# Altium project UCLA-DRS4.PrjPCB (part 5 of 10)

## Sheet CLK_SYNTH.SchDoc: My title
size A3; Organization: University of California; Address1: 475 Portola Plaza; Address2: Los Angeles, CA 90095; DocumentNumber: 14; Revision: R01; SheetNumber: 14; SheetTotal: 35
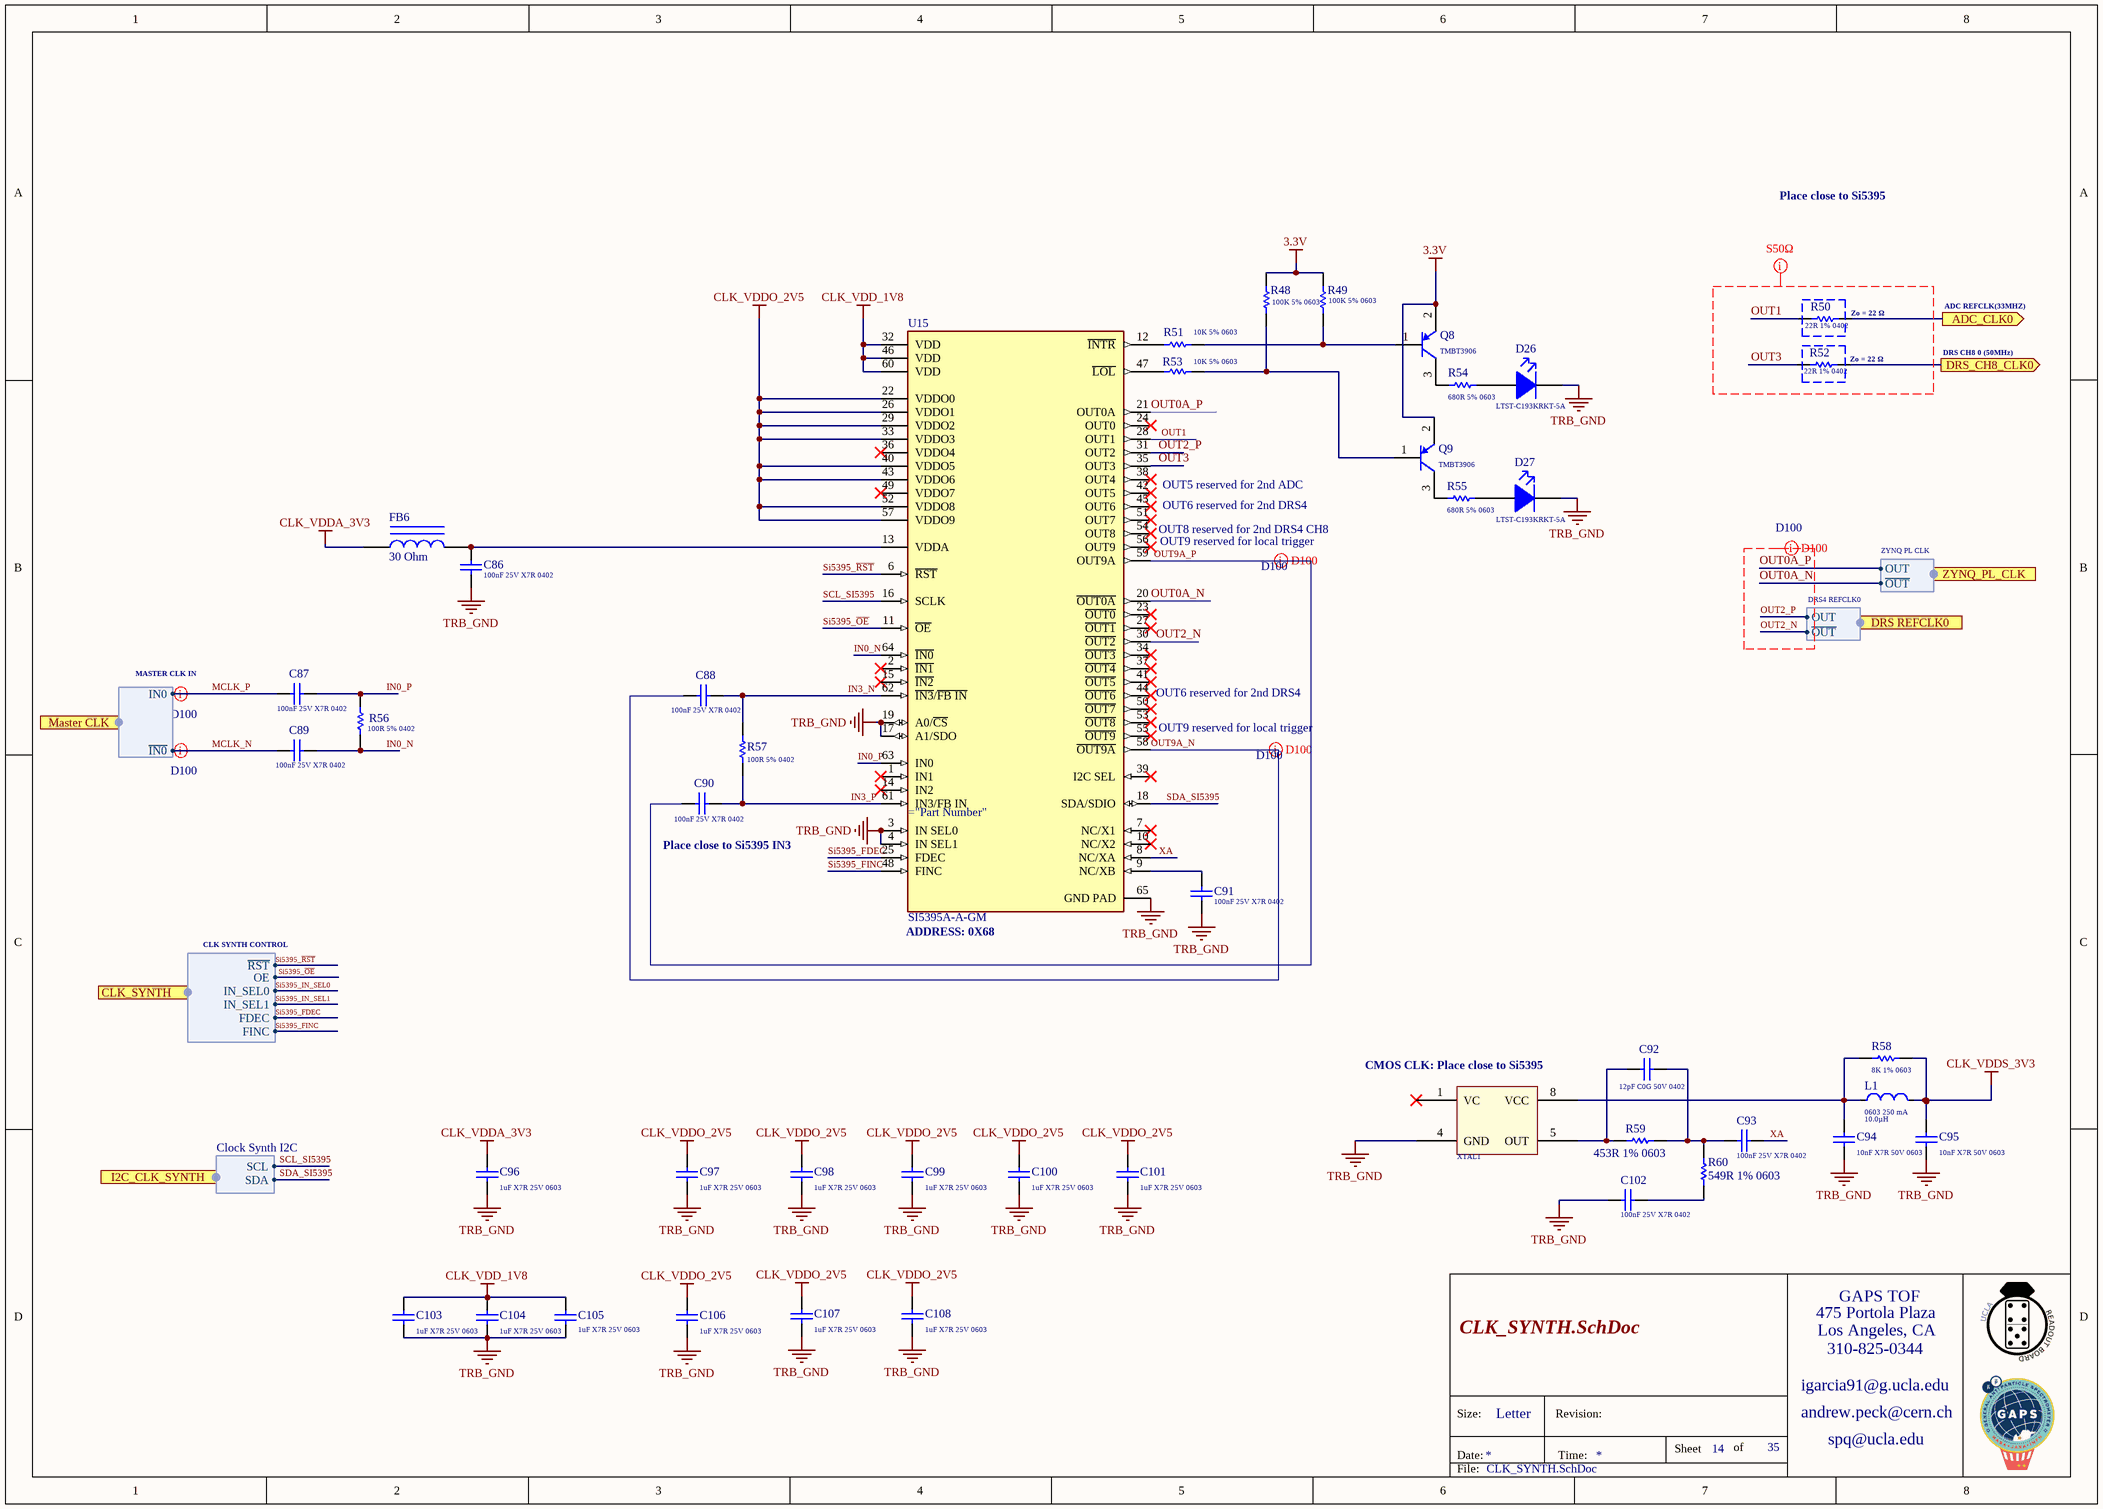
[diagram p9: CLK_SYNTH.SchDoc]

### Parts
C86  Capacitance: 100nF 25V X7R 0402  [Cap_Taiyo_Yuden_TMK105B7104KV-FR_100nF]  (hidden comment: Cap_Taiyo_Yuden_TMK105B7104KV-FR_100nF)
C87  Capacitance: 100nF 25V X7R 0402  [Cap_Taiyo_Yuden_TMK105B7104KV-FR_100nF]  (hidden comment: Cap_Taiyo_Yuden_TMK105B7104KV-FR_100nF)
C88  Capacitance: 100nF 25V X7R 0402  [Cap_Taiyo_Yuden_TMK105B7104KV-FR_100nF]  (hidden comment: Cap_Taiyo_Yuden_TMK105B7104KV-FR_100nF)
C89  Capacitance: 100nF 25V X7R 0402  [Cap_Taiyo_Yuden_TMK105B7104KV-FR_100nF]  (hidden comment: Cap_Taiyo_Yuden_TMK105B7104KV-FR_100nF)
C90  Capacitance: 100nF 25V X7R 0402  [Cap_Taiyo_Yuden_TMK105B7104KV-FR_100nF]  (hidden comment: Cap_Taiyo_Yuden_TMK105B7104KV-FR_100nF)
C91  Capacitance: 100nF 25V X7R 0402  [Cap_Taiyo_Yuden_TMK105B7104KV-FR_100nF]  (hidden comment: Cap_Taiyo_Yuden_TMK105B7104KV-FR_100nF)
C92  Capacitance: 12pF C0G 50V 0402  [Cap_Murata_GCQ1555C1H120FB01D_12pF]  (hidden comment: Cap_Murata_GCQ1555C1H120FB01D_12pF)
C93  Capacitance: 100nF 25V X7R 0402  [Cap_Taiyo_Yuden_TMK105B7104KV-FR_100nF]  (hidden comment: Cap_Taiyo_Yuden_TMK105B7104KV-FR_100nF)
C94  Capacitance: 10nF X7R 50V 0603  [Kemet_C0603_0]  (hidden comment: Cap_Kemet_C0603C103J5RACTU_eec)
C95  Capacitance: 10nF X7R 50V 0603  [Kemet_C0603_0]  (hidden comment: Cap_Kemet_C0603C103J5RACTU_eec)
C96  Capacitance: 1uF X7R 25V 0603  [Cap_Murata_GCJ188R71E105KA01J_1uF]  (hidden comment: Cap_Murata_GCJ188R71E105KA01J_1uF)
C97  Capacitance: 1uF X7R 25V 0603  [Cap_Murata_GCJ188R71E105KA01J_1uF]  (hidden comment: Cap_Murata_GCJ188R71E105KA01J_1uF)
C98  Capacitance: 1uF X7R 25V 0603  [Cap_Murata_GCJ188R71E105KA01J_1uF]  (hidden comment: Cap_Murata_GCJ188R71E105KA01J_1uF)
C99  Capacitance: 1uF X7R 25V 0603  [Cap_Murata_GCJ188R71E105KA01J_1uF]  (hidden comment: Cap_Murata_GCJ188R71E105KA01J_1uF)
C100  Capacitance: 1uF X7R 25V 0603  [Cap_Murata_GCJ188R71E105KA01J_1uF]  (hidden comment: Cap_Murata_GCJ188R71E105KA01J_1uF)
C101  Capacitance: 1uF X7R 25V 0603  [Cap_Murata_GCJ188R71E105KA01J_1uF]  (hidden comment: Cap_Murata_GCJ188R71E105KA01J_1uF)
C102  Capacitance: 100nF 25V X7R 0402  [Cap_Taiyo_Yuden_TMK105B7104KV-FR_100nF]  (hidden comment: Cap_Taiyo_Yuden_TMK105B7104KV-FR_100nF)
C103  Capacitance: 1uF X7R 25V 0603  [Cap_Murata_GCJ188R71E105KA01J_1uF]  (hidden comment: Cap_Murata_GCJ188R71E105KA01J_1uF)
C104  Capacitance: 1uF X7R 25V 0603  [Cap_Murata_GCJ188R71E105KA01J_1uF]  (hidden comment: Cap_Murata_GCJ188R71E105KA01J_1uF)
C105  Capacitance: 1uF X7R 25V 0603  [Cap_Murata_GCJ188R71E105KA01J_1uF]  (hidden comment: Cap_Murata_GCJ188R71E105KA01J_1uF)
C106  Capacitance: 1uF X7R 25V 0603  [Cap_Murata_GCJ188R71E105KA01J_1uF]  (hidden comment: Cap_Murata_GCJ188R71E105KA01J_1uF)
C107  Capacitance: 1uF X7R 25V 0603  [Cap_Murata_GCJ188R71E105KA01J_1uF]  (hidden comment: Cap_Murata_GCJ188R71E105KA01J_1uF)
C108  Capacitance: 1uF X7R 25V 0603  [Cap_Murata_GCJ188R71E105KA01J_1uF]  (hidden comment: Cap_Murata_GCJ188R71E105KA01J_1uF)
D26  LTST-C193KRKT-5A  [Led_Lite-On_LTST-C193KGKT-5A_Red]
D27  LTST-C193KRKT-5A  [Led_Lite-On_LTST-C193KGKT-5A_Red]
FB6  30 Ohm  [Feb_MURATA_BLM15AX300SZ1D_30]
L1  0603 250 mA  Inductance: 10.0µH  [TDK_MLZ1608M100WT_0]
Q8  Series: TMBT3906  [BJT_PNP_Toshiba_TMBT3906]  (hidden comment: BJT_PNP_Toshiba_TMBT3906)
Q9  Series: TMBT3906  [BJT_PNP_Toshiba_TMBT3906]  (hidden comment: BJT_PNP_Toshiba_TMBT3906)
R48  100K 5% 0603  [RESC0603(1608)_N]
R49  100K 5% 0603  [RESC0603(1608)_N]
R50  22R 1% 0402  [RESC0402(1005)_L]
R51  10K 5% 0603  [RESC0603(1608)_L]
R52  22R 1% 0402  [RESC0402(1005)_L]
R53  10K 5% 0603  [RESC0603(1608)_L]
R54  680R 5% 0603  [RESC0603(1608)_L]
R55  680R 5% 0603  [RESC0603(1608)_L]
R56  100R 5% 0402  [RESC0402(1005)_L]
R57  100R 5% 0402  [RESC0402(1005)_L]
R58  8K 1% 0603  [Res_Yageo_RT0603BRE078KL_8K]
R59  453R 1% 0603  [RESC1608X55X30NL15T15]
R60  549R 1% 0603  [RESC1608X55X30NL15T15]
U15  Series: SI5395A-A-GM  [Si5395]  (hidden comment: IC_Silicon_Laboratories_ SI5395A-A-GM_CLK)
XTAL1  TCXO_Murata_XTCLH50M000CHJA3P0_50MHz  [TCXO_Murata_XTCLH50M000CHJA3P0_50MHz]  (value not drawn)

### Ports
ADC_CLK0 (out), CLK_SYNTH (harness CLK SYNTH CONTROL), DRS REFCLK0 (harness DRS4 REFCLK0), DRS_CH8_CLK0 (out), I2C_CLK_SYNTH (harness Clock Synth I2C), Master CLK (harness MASTER CLK IN), ZYNQ_PL_CLK (harness ZYNQ PL CLK)

### Harnesses
MASTER CLK IN: IN0, ~{IN0}
CLK SYNTH CONTROL: ~{RST}, OE, IN_SEL0, IN_SEL1, FDEC, FINC
DRS4 REFCLK0: OUT, ~{OUT}
ZYNQ PL CLK: OUT, ~{OUT}
Clock Synth I2C: SCL, SDA

### Nets
3.3V: Q8.2(E) Q9.2(E) R48.2 R49.2
CLK_VDD_1V8: C103.2 C104.2 C105.2 U15.32(VDD) U15.46(VDD) U15.60(VDD)
CLK_VDDA_3V3: C96.2 FB6.1
CLK_VDDO_2V5: C97.2 C98.2 C99.2 C100.2 C101.2 C106.2 C107.2 C108.2 U15.22(VDDO0) U15.26(VDDO1) U15.29(VDDO2) U15.33(VDDO3) U15.40(VDDO5) U15.43(VDDO6) U15.52(VDDO8) U15.57(VDDO9)
CLK_VDDS_3V3: C95.1 L1.2 R58.2
TRB_GND: C86.1 C91.1 C94.2 C95.2 C96.1 C97.1 C98.1 C99.1 C100.1 C101.1 C102.1 C103.1 C104.1 C105.1 C106.1 C107.1 C108.1 D26.1(K) D27.1(K) U15.3(IN_SEL0) U15.4(IN_SEL1) U15.17(A1/SDO) U15.19(A0/~{CS}) U15.65(GND_PAD) XTAL1.4(GND)
ADC_CLK: R50.1 ; port ADC_CLK0
CLK_SYNTH_8: R52.1 ; port DRS_CH8_CLK0
IN0_N: C89.2 R56.1 U15.64(~{IN0})
IN0_P: C87.2 R56.2 U15.63(IN0)
IN3_N: C88.2 R57.2 U15.62(~{IN3}/~{FB_IN})
IN3_P: C90.2 R57.1 U15.61(IN3/FB_IN)
MCLK_N: C89.1 ; port Master CLK.~{IN0}
MCLK_P: C87.1 ; port Master CLK.IN0
OUT0A_N: U15.20(~{OUT0A}) ; port ZYNQ_PL_CLK.~{OUT}
OUT0A_P: U15.21(OUT0A) ; port ZYNQ_PL_CLK.OUT
OUT1: R50.2 U15.28(OUT1)
OUT2_N: U15.30(~{OUT2}) ; port DRS REFCLK0.~{OUT}
OUT2_P: U15.31(OUT2) ; port DRS REFCLK0.OUT
OUT3: R52.2 U15.35(OUT3)
OUT9A_N: C88.1 U15.58(~{OUT9A})
OUT9A_P: C90.1 U15.59(OUT9A)
SCL_SI5395: U15.16(SCLK) ; port I2C_CLK_SYNTH.SCL
SDA_SI5395: U15.18(SDA/SDIO) ; port I2C_CLK_SYNTH.SDA
Si5395_FDEC: U15.25(FDEC) ; port CLK_SYNTH.FDEC
Si5395_FINC: U15.48(FINC) ; port CLK_SYNTH.FINC
Si5395_IN_SEL0: port CLK_SYNTH.IN_SEL0
Si5395_IN_SEL1: port CLK_SYNTH.IN_SEL1
Si5395_~{OE}: U15.11(~{OE}) ; port CLK_SYNTH.OE
Si5395_~{RST}: U15.6(~{RST}) ; port CLK_SYNTH.~{RST}
XA: C93.2 U15.8(NC/XA)
NetC86_2: C86.2 FB6.2 U15.13(VDDA)
NetC91_2: C91.2 U15.9(NC/XB)
NetC92_1: C92.1 C93.1 R59.2 R60.2
NetC92_2: C92.2 R59.1 XTAL1.5(OUT)
NetC94_1: C94.1 L1.1 R58.1 XTAL1.8(VCC)
NetC102_2: C102.2 R60.1
NetD26_2: D26.2(A) R54.2
NetD27_2: D27.2(A) R55.2
NetQ8_1: Q8.1(B) R49.1 R51.1
NetQ8_3: Q8.3(C) R54.1
NetQ9_1: Q9.1(B) R48.1 R53.1
NetQ9_3: Q9.3(C) R55.1
NetR51_2: R51.2 U15.12(~{INTR})
NetR53_2: R53.2 U15.47(~{LOL})

Not connected (* = marked no-connect by the designer): U15 1(IN1)* 2(~{IN1})* 7(NC/X1)* 10(NC/X2)* 14(IN2)* 15(~{IN2})* 23(~{OUT0})* 24(OUT0)* 27(~{OUT1})* 34(~{OUT3})* 36(VDDO4)* 37(~{OUT4})* 38(OUT4)* 39(I2C_SEL)* 41(~{OUT5})* 42(OUT5)* 44(~{OUT6})* 45(OUT6)* 49(VDDO7)* 50(~{OUT7})* 51(OUT7)* 53(~{OUT8})* 54(OUT8)* 55(~{OUT9})* 56(OUT9)*; XTAL1 1(VC)*

### Layout directives
differential pair; differential pair class D100: OUT0A_N, OUT0A_P, OUT2_N, OUT2_P, OUT9A_N, OUT9A_P
net class S50: OUT1, OUT3
differential pair; differential pair class D100; rule Matched Net Lengths [Tolerance = 100mil]: MCLK_N, MCLK_P

### Notes on the sheet
- Place close to Si5395
- (near R50) Zo = 22 Ω
- ADC REFCLK(33MHZ)
- (near R52) Zo = 22 Ω
- DRS CH8 0 (50MHz)
- (near U15) OUT5 reserved for 2nd ADC
- (near U15) OUT6 reserved for 2nd DRS4
- (near U15) OUT8 reserved for 2nd DRS4 CH8
- (near U15) OUT9 reserved for local trigger
- (near C90) Place close to Si5395 IN3
- (near U15) ADDRESS: 0X68
- (near XTAL1) CMOS CLK: Place close to Si5395
- 475 Portola Plaza
- GAPS TOF
- igarcia91@g.ucla.edu
- Los Angeles, CA
- 310-825-0344
- Size:
- Date:
- Letter
- Revision:
- Time:
- Sheet
- of
- andrew.peck@cern.ch
- spq@ucla.edu
- File:

### Library data of the parts
C86-C91 C93 C102 = Cap_Taiyo_Yuden_TMK105B7104KV-FR_100nF: CAP CER 100nF 25V X7R 0402; Supplier 1: Mouser; Supplier Part Number 1: 963-TMK105B7104KV-FR
C92 = Cap_Murata_GCQ1555C1H120FB01D_12pF: MLCC - SMD/SMT 0402 50VDC 12pF 1% AEC-Q200; Manufacturer 1: Murata; Supplier 1: Mouser; Supplier Part Number 1: 81-GCQ1555C1H120FB1D; Manufacturer Part Number 1: GCQ1555C1H120FB01D
C94 C95 = Cap_Kemet_C0603C103J5RACTU_eec: CAP CER 10nF 50V X7R 0603; Manufacturer: Kemet; Mfg Package Ident: C0603; Part Number: C0603C103J5RACTU; helpURL: https://upverter.com/upn/revision/8a8d0c297e33ac74/; ComponentLink2Description: Datasheet; Temperature: -55°C to +125°C; Package: C0603; Supplier 2: Mouser; Price: 0.0184203126773; Supplier 1: Digi-Key; ComponentLink1URL: https://upverter.com/upn/revision/8a8d0c297e33ac74/; Supplier Part Number 2: 80-C0603C103J5R; Supplier Part Number 1: 399-1092-1-ND; Value: 10nF; ComponentLink1Description: Upverter; ComponentLink2URL: https://content.kemet.com/datasheets/KEM_C1002_X7R_SMD.pdf; RoHS: TRUE; Mouser Part Number: 80-C0603C103J5R; Temperature Range High: +125°C; Digikey Description: CAP CER 10000PF 50V X7R 0603; Digikey Part Number: 399-1092-1-ND; Lead Free: yes; Temperature Range Low: -55°C; Voltage: 50V
C96-C101 C103-C108 = Cap_Murata_GCJ188R71E105KA01J_1uF: CAP CER 1uF 25V X7R 0603; Supplier 1: Mouser; Supplier Part Number 1: 81-GCJ188R71E105KA1J
D26 D27 = Led_Lite-On_LTST-C193KGKT-5A_Red: Standard LEDs - SMD Red 470nm 28mcd 20mA; Supplier 1: Mouser; Supplier Part Number 1: 859-LTSTC193KRKT5A; Series: LTST-C193KRKT-5A
FB6 = Feb_MURATA_BLM15AX300SZ1D_30: Feb SMD 30 OHM 25% 3/4W 0402; Supplier 1: Mouser; Supplier Part Number 1: 81-BLM15AX300SZ1D
L1 = Ind_TDK_MLZ1608M100WT_eec: IND 10µH Shielded Multilayer Inductor 250mA 1.365 Ohm Max 0603 (1608 Metric); Manufacturer: TDK; Value: 10.0µH; Tolerance: ±20%; Part Number: MLZ1608M100WT; helpURL: https://upverter.com/upn/revision/22fa022ced0eb0ec/; ComponentLink2Description: Datasheet; Temperature: -55°C to +125°C; Package: 0603 (1608 metric); Supplier 2: Mouser; Supplier 1: Digi-Key; ComponentLink1URL: https://upverter.com/upn/revision/22fa022ced0eb0ec/; Supplier Part Number 2: 810-MLZ1608M100WT000; Supplier Part Number 1: 445-6389-1-ND; ComponentLink1Description: Upverter; ComponentLink2URL: https://product.tdk.com/info/en/catalog/datasheets/inductor_commercial_decoupling_mlz1608_en.pdf; RoHS: TRUE; Mouser Part Number: 810-MLZ1608M100WT000; Current Rating: 250mA; Ipc Land Pattern Name: CAPC16080X45; Temperature Range High: +125°C; Digikey Description: IND 10µH Shielded Multilayer Inductor 250mA 1.365 Ohm Max 0603 (1608 Metric); Digikey Part Number: 445-6389-1-ND; Lead Free: yes; Temperature Range Low: -55°C; DC Resistance (DCR): 1.365 Ohm Max
Q8 Q9 = BJT_PNP_Toshiba_TMBT3906: Bipolar Transistors - BJT Transistor for Low Freq. Amplification; Manufacturer Part Number 1: TMBT3906,LM; Supplier Part Number 1: 757-TMBT3906LM; Supplier 1: Mouser; Manufacturer: Toshiba
R48 R49 = CMP-1012-00122-1: 100K 0.1W 5% 0603 (1608 Metric)  SMD; Case-EIA: 0603; Value: 100000.00 Ohm; Case-Metric: 1608; Tolerance: 5 %; Power: 0.1 W; Technology: SMT
R50 R52 = CMP-1011-00320-1: 22R 0.063W 1% 0402 (1005 Metric)  SMD; Case-EIA: 0402; Case-Metric: 1005; Value: 22.00 Ohm; Tolerance: 1 %; Technology: SMT; Power: 0.063 W
R51 R53 = CMP-1012-00098-1: 10K 0.1W 5% 0603 (1608 Metric)  SMD; Case-EIA: 0603; Value: 10000.00 Ohm; Case-Metric: 1608; Technology: SMT; Tolerance: 5 %; Power: 0.1 W
R54 R55 = CMP-1012-00070-1: 680R 0.1W 5% 0603 (1608 Metric)  SMD; Case-EIA: 0603; Value: 680.00 Ohm; Case-Metric: 1608; Tolerance: 5 %; Technology: SMT; Power: 0.1 W
R56 R57 = CMP-1011-00050-1: 100R 0.063W 5% 0402 (1005 Metric)  SMD; Case-EIA: 0402; Value: 100.00 Ohm; Case-Metric: 1005; Tolerance: 5 %; Technology: SMT; Power: 0.063 W
R58 = Res_Yageo_RT0603BRE078KL_8K: 8K 0.1W 1% 0603 (1608 Metric)  SMD; Supplier 1: Mouser; Supplier Part Number 1: 603-RT0603BRE078KL
R59 = CMP-2000-00511-1: ERJ-3EKF4530V; Manufacturer: Panasonic; Part Number: ERJ-3EKF4530V
R60 = CMP-2000-00559-1: ERJ-3EKF5490V; Manufacturer: Panasonic; Part Number: ERJ-3EKF5490V
U15 = IC_Silicon_Laboratories_ SI5395A-A-GM_CLK: Clock Synthesizer / Jitter Cleaner Single PLL jitter attenuator with xtal: 12-outputs up to 1028 MHz; integer+fractional; Supplier 1: Mouser; Supplier Part Number 1: 634-SI5395A-A-GM
XTAL1 = TCXO_Murata_XTCLH50M000CHJA3P0_50MHz: TCXO Oscillators 50MHz 5x3.2x1.5mm 0.2ppm max Crystal; Supplier 1: Mouser; Supplier Part Number 1: 81-XTCLH50M000CHJA3P; Supplier 2: Digi-Key; Supplier Part Number 2: 490-18042-1-ND

## Sheet TCA_MODULE.SchDoc: My title
size A3; Organization: University of California; Address1: 475 Portola Plaza; Address2: Los Angeles, CA 90095; DocumentNumber: 25; Revision: R01; SheetNumber: 25; SheetTotal: 35
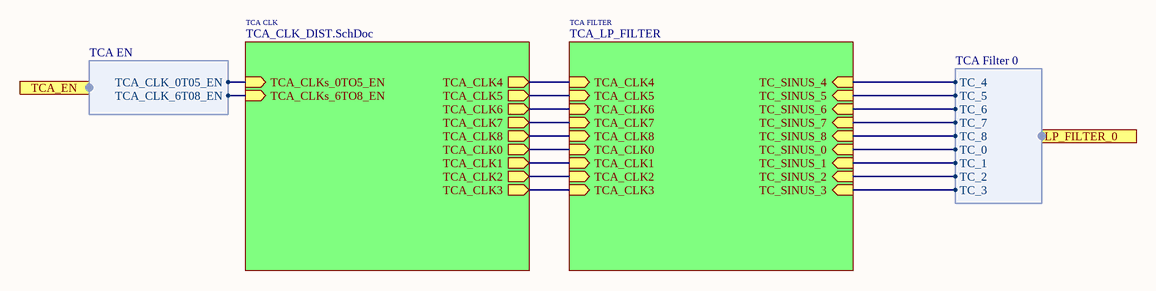
[diagram p10: TCA_MODULE.SchDoc]

### Sub-sheets
TCA CLK = TCA_CLK_DIST.SchDoc: TCA_CLK4 (out), TCA_CLK5 (out), TCA_CLK6 (out), TCA_CLK7 (out), TCA_CLK8 (out), TCA_CLK0 (out), TCA_CLK1 (out), TCA_CLK2 (out), TCA_CLKs_0TO5_EN (in), TCA_CLKs_6TO8_EN (in), TCA_CLK3 (out)
TCA FILTER = TCA_LP_FILTER: TCA_CLK4 (in), TCA_CLK5 (in), TCA_CLK6 (in), TCA_CLK0 (in), TCA_CLK1 (in), TCA_CLK2 (in), TCA_CLK3 (in), TCA_CLK7 (in), TCA_CLK8 (in), TC_SINUS_4 (in), TC_SINUS_5 (in), TC_SINUS_6 (in), TC_SINUS_0 (in), TC_SINUS_1 (in), TC_SINUS_2 (in), TC_SINUS_3 (in), TC_SINUS_7 (in), TC_SINUS_8 (in)

### Ports
LP_FILTER_0 (harness TCA Filter 0), TCA_EN (harness TCA EN)

### Harnesses
TCA Filter 0: TC_4, TC_5, TC_6, TC_7, TC_8, TC_0, TC_1, TC_2, TC_3
TCA EN: TCA_CLK_0T05_EN, TCA_CLK_6T08_EN

### Nets
TC_0: sheet TCA FILTER/TC_SINUS_0, port LP_FILTER_0.TC_0
TC_1: sheet TCA FILTER/TC_SINUS_1, port LP_FILTER_0.TC_1
TC_2: sheet TCA FILTER/TC_SINUS_2, port LP_FILTER_0.TC_2
TC_3: sheet TCA FILTER/TC_SINUS_3, port LP_FILTER_0.TC_3
TC_4: sheet TCA FILTER/TC_SINUS_4, port LP_FILTER_0.TC_4
TC_5: sheet TCA FILTER/TC_SINUS_5, port LP_FILTER_0.TC_5
TC_6: sheet TCA FILTER/TC_SINUS_6, port LP_FILTER_0.TC_6
TC_7: sheet TCA FILTER/TC_SINUS_7, port LP_FILTER_0.TC_7
TC_8: sheet TCA FILTER/TC_SINUS_8, port LP_FILTER_0.TC_8
TCA_CLK0: sheet TCA CLK/TCA_CLK0, sheet TCA FILTER/TCA_CLK0
TCA_CLK1: sheet TCA CLK/TCA_CLK1, sheet TCA FILTER/TCA_CLK1
TCA_CLK2: sheet TCA CLK/TCA_CLK2, sheet TCA FILTER/TCA_CLK2
TCA_CLK3: sheet TCA CLK/TCA_CLK3, sheet TCA FILTER/TCA_CLK3
TCA_CLK4: sheet TCA CLK/TCA_CLK4, sheet TCA FILTER/TCA_CLK4
TCA_CLK5: sheet TCA CLK/TCA_CLK5, sheet TCA FILTER/TCA_CLK5
TCA_CLK6: sheet TCA CLK/TCA_CLK6, sheet TCA FILTER/TCA_CLK6
TCA_CLK7: sheet TCA CLK/TCA_CLK7, sheet TCA FILTER/TCA_CLK7
TCA_CLK8: sheet TCA CLK/TCA_CLK8, sheet TCA FILTER/TCA_CLK8
TCA_CLK_0T05_EN: sheet TCA CLK/TCA_CLKs_0TO5_EN, port TCA_EN.TCA_CLK_0T05_EN
TCA_CLK_6T08_EN: sheet TCA CLK/TCA_CLKs_6TO8_EN, port TCA_EN.TCA_CLK_6T08_EN

### Notes on the sheet
- 475 Portola Plaza
- GAPS TOF
- igarcia91@g.ucla.edu
- Los Angeles, CA
- 310-825-0344
- Size:
- Date:
- Letter
- Revision:
- Time:
- Sheet
- of
- andrew.peck@cern.ch
- spq@ucla.edu
- File:

## Sheet TCA_CLK_DIST.SchDoc: My title
size A3; Organization: University of California; Address1: 475 Portola Plaza; Address2: Los Angeles, CA 90095; DocumentNumber: 26; Revision: R01; SheetNumber: 26; SheetTotal: 35
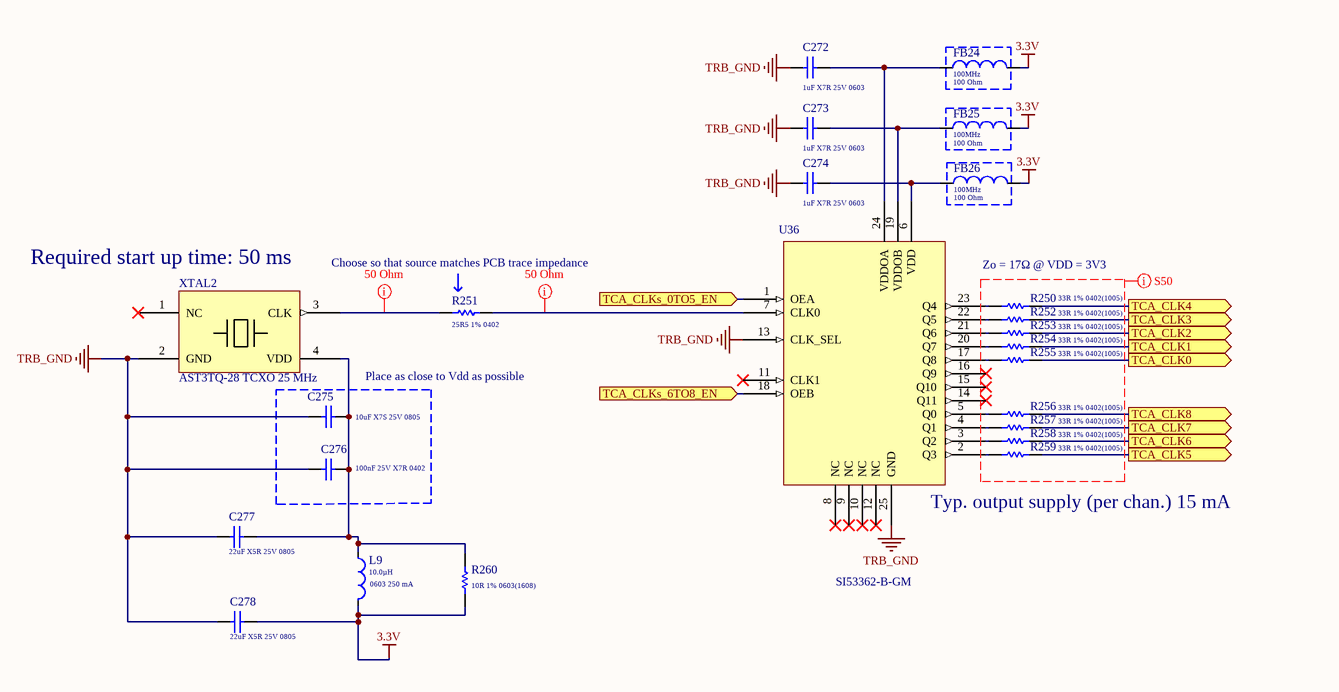
[diagram p11: TCA_CLK_DIST.SchDoc]

### Parts
C272  Capacitance: 1uF X7R 25V 0603  [Cap_Murata_GCJ188R71E105KA01J_1uF]  (hidden comment: Cap_Murata_GCJ188R71E105KA01J_1uF)
C273  Capacitance: 1uF X7R 25V 0603  [Cap_Murata_GCJ188R71E105KA01J_1uF]  (hidden comment: Cap_Murata_GCJ188R71E105KA01J_1uF)
C274  Capacitance: 1uF X7R 25V 0603  [Cap_Murata_GCJ188R71E105KA01J_1uF]  (hidden comment: Cap_Murata_GCJ188R71E105KA01J_1uF)
C275  Capacitance: 10uF X7S 25V 0805  [Cap_Murata_ GRM21BC71E106ME11L_10uF]  (hidden comment: Cap_Murata_ GRM21BC71E106ME11L_10uF)
C276  Capacitance: 100nF 25V X7R 0402  [Cap_Taiyo_Yuden_TMK105B7104KV-FR_100nF]  (hidden comment: Cap_Taiyo_Yuden_TMK105B7104KV-FR_100nF)
C277  Capacitance: 22uF X5R 25V 0805  [Cap_Murata_GRT21BR61E226ME13L_22uF]  (hidden comment: Cap_Murata_GRT21BR61E226ME13L_22uF)
C278  Capacitance: 22uF X5R 25V 0805  [Cap_Murata_GRT21BR61E226ME13L_22uF]  (hidden comment: Cap_Murata_GRT21BR61E226ME13L_22uF)
FB24  Measuring Frequency: 100MHz  Impedance: 100 Ohm  [FB_Wurth_Electronics_742792731_100Ohms]  (hidden comment: 742792731)
FB25  Measuring Frequency: 100MHz  Impedance: 100 Ohm  [FB_Wurth_Electronics_742792731_100Ohms]  (hidden comment: 742792731)
FB26  Measuring Frequency: 100MHz  Impedance: 100 Ohm  [FB_Wurth_Electronics_742792731_100Ohms]  (hidden comment: 742792731)
L9  0603 250 mA  Inductance: 10.0µH  [TDK_MLZ1608M100WT_0]
R250  33R 1% 0402(1005)  [RESC0402(1005)_L]
R251  25R5 1% 0402  [RESC0402(1005)_L]
R252  33R 1% 0402(1005)  [RESC0402(1005)_L]
R253  33R 1% 0402(1005)  [RESC0402(1005)_L]
R254  33R 1% 0402(1005)  [RESC0402(1005)_L]
R255  33R 1% 0402(1005)  [RESC0402(1005)_L]
R256  33R 1% 0402(1005)  [RESC0402(1005)_L]
R257  33R 1% 0402(1005)  [RESC0402(1005)_L]
R258  33R 1% 0402(1005)  [RESC0402(1005)_L]
R259  33R 1% 0402(1005)  [RESC0402(1005)_L]
R260  10R 1% 0603(1608)  [RESC0603(1608)_L]
U36  SI53362-B-GM  [Si53362]
XTAL2  AST3TQ-28 TCXO 25 MHz  [XTAL_ASDM1-25.000MHZ-LC-T]

### Blocks framed on the sheet
Place as close to Vdd as possible: C275 C276

### Ports
TCA_CLK0 (out), TCA_CLK1 (out), TCA_CLK2 (out), TCA_CLK3 (out), TCA_CLK4 (out), TCA_CLK5 (out), TCA_CLK6 (out), TCA_CLK7 (out), TCA_CLK8 (out), TCA_CLKs_0TO5_EN (in), TCA_CLKs_6TO8_EN (in)

### Nets
3.3V: C278.2 FB24.2 FB25.2 FB26.2 L9.2 R260.1
TRB_GND: C272.2 C273.2 C274.2 C275.1 C276.2 C277.1 C278.1 U36.13(CLK_SEL) U36.25(GND) XTAL2.2(GND)
TCA_CLK0: R255.2 ; port TCA_CLK0
TCA_CLK1: R254.2 ; port TCA_CLK1
TCA_CLK2: R253.2 ; port TCA_CLK2
TCA_CLK3: R252.2 ; port TCA_CLK3
TCA_CLK4: R250.2 ; port TCA_CLK4
TCA_CLK5: R259.2 ; port TCA_CLK5
TCA_CLK6: R258.2 ; port TCA_CLK6
TCA_CLK7: R257.2 ; port TCA_CLK7
TCA_CLK8: R256.2 ; port TCA_CLK8
TCA_CLK_0T05_EN: U36.1(OEA) ; port TCA_CLKs_0TO5_EN
TCA_CLK_6T08_EN: U36.18(OEB) ; port TCA_CLKs_6TO8_EN
NetC272_1: C272.1 FB24.1 U36.24(VDDOA)
NetC273_1: C273.1 FB25.1 U36.19(VDDOB)
NetC274_1: C274.1 FB26.1 U36.6(VDD)
NetC275_2: C275.2 C276.1 C277.2 L9.1 R260.2 XTAL2.4(VDD)
NetR250_1: R250.1 U36.23(Q4)
NetR251_1: R251.1 XTAL2.3(CLK)
NetR251_2: R251.2 U36.7(CLK0)
NetR252_1: R252.1 U36.22(Q5)
NetR253_1: R253.1 U36.21(Q6)
NetR254_1: R254.1 U36.20(Q7)
NetR255_1: R255.1 U36.17(Q8)
NetR256_1: R256.1 U36.5(Q0)
NetR257_1: R257.1 U36.4(Q1)
NetR258_1: R258.1 U36.3(Q2)
NetR259_1: R259.1 U36.2(Q3)

Not connected (* = marked no-connect by the designer): U36 8(NC)* 9(NC)* 10(NC)* 11(CLK1)* 12(NC)* 14(Q11)* 15(Q10)* 16(Q9)*; XTAL2 1(NC)*

### Layout directives
net class S50: (no net found under the mark)

### Notes on the sheet
- (near XTAL2) Required start up time: 50 ms
- Choose so that source matches PCB trace impedance
- Zo = 17Ω @ VDD = 3V3
- (near U36) Typ. output supply (per chan.) 15 mA
- 475 Portola Plaza
- GAPS TOF
- igarcia91@g.ucla.edu
- Los Angeles, CA
- 310-825-0344
- Size:
- Date:
- Letter
- Revision:
- Time:
- Sheet
- of
- andrew.peck@cern.ch
- spq@ucla.edu
- File:

### Library data of the parts
C272-C274 = Cap_Murata_GCJ188R71E105KA01J_1uF: CAP CER 1uF 25V X7R 0603; Supplier 1: Mouser; Supplier Part Number 1: 81-GCJ188R71E105KA1J
C275 = Cap_Murata_ GRM21BC71E106ME11L_10uF: CAP CER 10uF 25V X7R 0805; Supplier 1: Mouser; Supplier Part Number 1: 81-GRM21BC71E106ME1L
C276 = Cap_Taiyo_Yuden_TMK105B7104KV-FR_100nF: CAP CER 100nF 25V X7R 0402; Supplier 1: Mouser; Supplier Part Number 1: 963-TMK105B7104KV-FR
C277 C278 = Cap_Murata_GRT21BR61E226ME13L_22uF: CAP CER 22uF 25V X5R 0805; Supplier 1: Mouser; Supplier Part Number 1: 81-GRT21BR61E226ME3L
FB24-FB26 = FB_Wurth_Electronics_742792731_100Ohms: FB SMD 100 OHM 25% 1.2A 0402; DC Resistance: 90mOhm; Supplier 1: Mouser; Supplier Part Number 1: 710-742792731
L9 = Ind_TDK_MLZ1608M100WT_eec: as L1 on sheet CLK_SYNTH; Part Number: MLZ1608M100WT; helpURL: https://upverter.com/upn/revision/22fa022ced0eb0ec/; ComponentLink2Description: Datasheet; Temperature: -55°C to +125°C; Package: 0603 (1608 metric); Supplier 2: Mouser; Supplier 1: Digi-Key; ComponentLink1URL: https://upverter.com/upn/revision/22fa022ced0eb0ec/; Supplier Part Number 2: 810-MLZ1608M100WT000; Supplier Part Number 1: 445-6389-1-ND; ComponentLink1Description: Upverter; ComponentLink2URL: https://product.tdk.com/info/en/catalog/datasheets/inductor_commercial_decoupling_mlz1608_en.pdf; RoHS: TRUE; Mouser Part Number: 810-MLZ1608M100WT000; Current Rating: 250mA; Ipc Land Pattern Name: CAPC16080X45; Temperature Range High: +125°C; Digikey Description: IND 10µH Shielded Multilayer Inductor 250mA 1.365 Ohm Max 0603 (1608 Metric); Digikey Part Number: 445-6389-1-ND; Lead Free: yes; Temperature Range Low: -55°C; DC Resistance (DCR): 1.365 Ohm Max
R250 R252-R259 = CMP-1011-00341-1: 33R 0.063W 1% 0402 (1005 Metric)  SMD; Case-Metric: 1005; Value: 33.00 Ohm; Case-EIA: 0402; Tolerance: 1 %; Power: 0.063 W; Technology: SMT
R251 = CMP-1011-00328-1: 25R5 0.063W 1% 0402 (1005 Metric)  SMD; Case-EIA: 0402; Case-Metric: 1005; Value: 25.50 Ohm; Tolerance: 1 %; Power: 0.063 W; Technology: SMT
R260 = CMP-1012-00284-1: 10R 0.1W 1% 0603 (1608 Metric)  SMD; Case-Metric: 1608; Case-EIA: 0603; Value: 10.00 Ohm; Tolerance: 1 %; Power: 0.1 W; Technology: SMT
U36 = SI53362-B-GM: Clock Buffer LVCMOS 2:12 buffer (200MHz), 2:1 LVCMOS input max, output enable (QFN24); Supplier 1: Mouser; Supplier Part Number 1: 634-SI53362-B-GM
XTAL2 = AST3TQ-28: TCXO Oscillators 25MHz 3.3Volt LVCMOS 0.280 ppm -40C 85C; Manufacturer 1: Abracon LLC; Manufacturer Part Number 1: AST3TQ-T-25.000MHZ-28; Supplier 1: Digikey; Supplier Part Number 1: 535-12700-ND

## Sheet TCA_LP_FILTER.SchDoc: My title
size A3; Organization: University of California; Address1: 475 Portola Plaza; Address2: Los Angeles, CA 90095; DocumentNumber: 23; Revision: R01; SheetNumber: 23; SheetTotal: 35
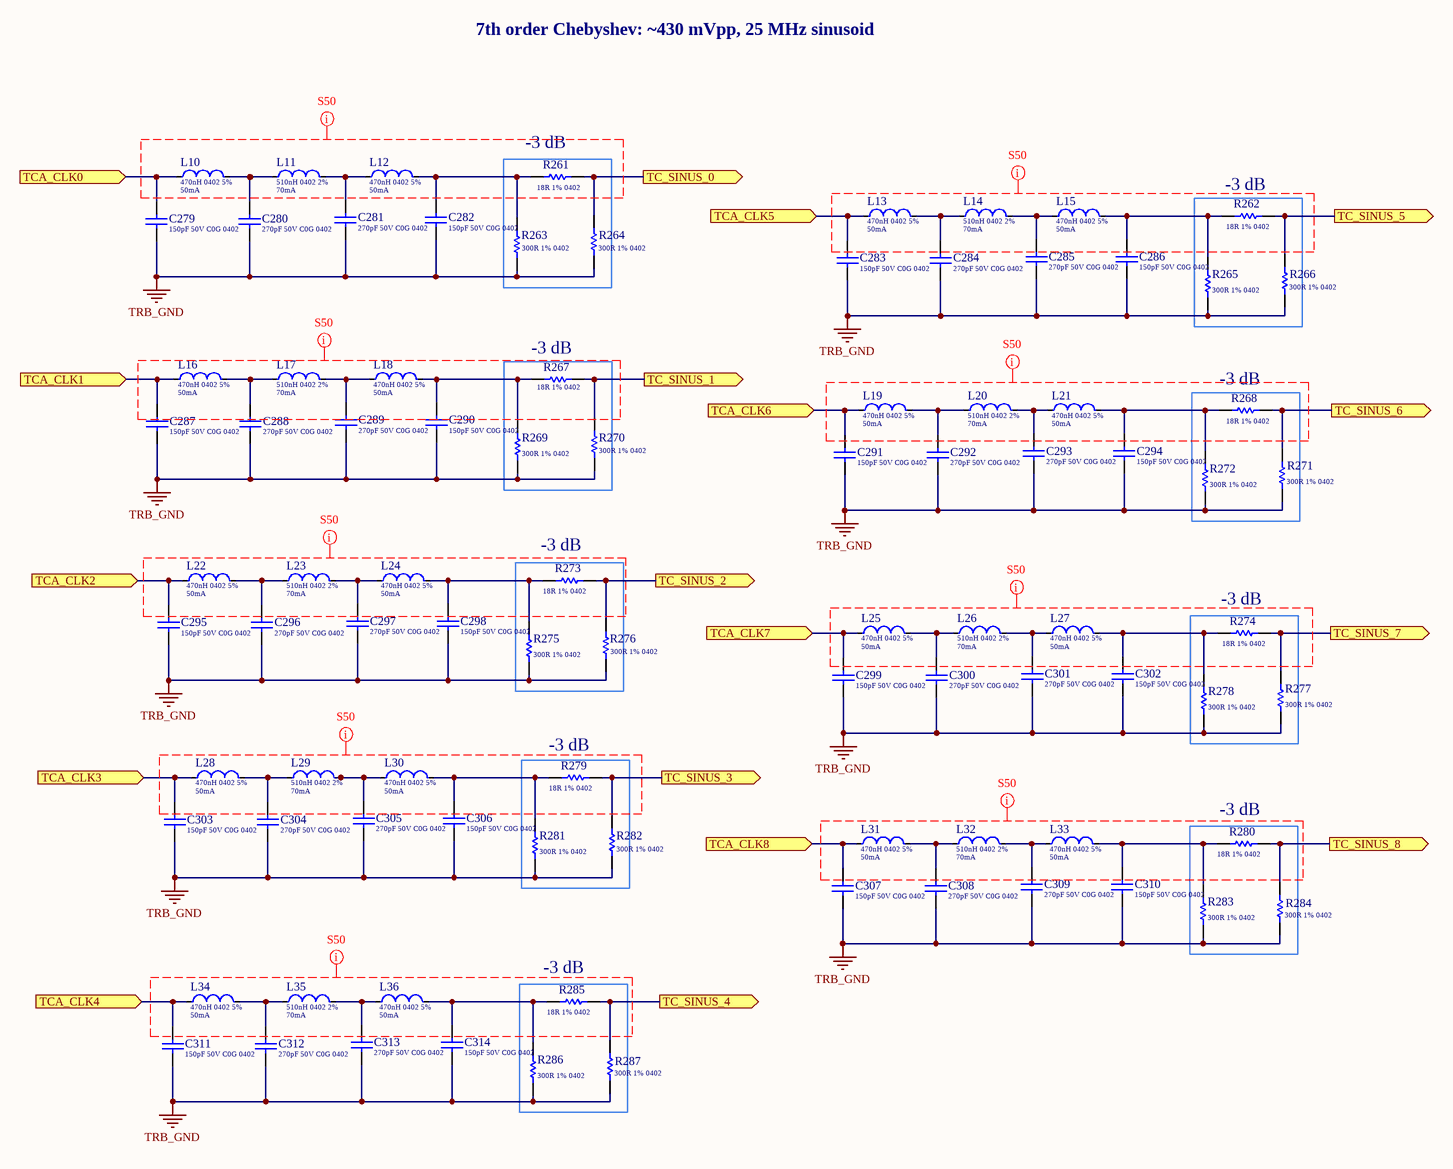
[diagram p12: TCA_LP_FILTER.SchDoc]

### Parts
C279  Capacitance: 150pF 50V C0G 0402  [Cap_TDK_CGA2B2C0G2A151J050BE_150pF]  (hidden comment: Cap_TDK_CGA2B2C0G2A151J050BE_150pF)
C280  Capacitance: 270pF 50V C0G 0402  [Cap_Murata_GCM1555C1H271FA16D_270pF]  (hidden comment: Cap_Murata_GCM1555C1H271FA16D_270pF)
C281  Capacitance: 270pF 50V C0G 0402  [Cap_Murata_GCM1555C1H271FA16D_270pF]  (hidden comment: Cap_Murata_GCM1555C1H271FA16D_270pF)
C282  Capacitance: 150pF 50V C0G 0402  [Cap_TDK_CGA2B2C0G2A151J050BE_150pF]  (hidden comment: Cap_TDK_CGA2B2C0G2A151J050BE_150pF)
C283  Capacitance: 150pF 50V C0G 0402  [Cap_TDK_CGA2B2C0G2A151J050BE_150pF]  (hidden comment: Cap_TDK_CGA2B2C0G2A151J050BE_150pF)
C284  Capacitance: 270pF 50V C0G 0402  [Cap_Murata_GCM1555C1H271FA16D_270pF]  (hidden comment: Cap_Murata_GCM1555C1H271FA16D_270pF)
C285  Capacitance: 270pF 50V C0G 0402  [Cap_Murata_GCM1555C1H271FA16D_270pF]  (hidden comment: Cap_Murata_GCM1555C1H271FA16D_270pF)
C286  Capacitance: 150pF 50V C0G 0402  [Cap_TDK_CGA2B2C0G2A151J050BE_150pF]  (hidden comment: Cap_TDK_CGA2B2C0G2A151J050BE_150pF)
C287  Capacitance: 150pF 50V C0G 0402  [Cap_TDK_CGA2B2C0G2A151J050BE_150pF]  (hidden comment: Cap_TDK_CGA2B2C0G2A151J050BE_150pF)
C288  Capacitance: 270pF 50V C0G 0402  [Cap_Murata_GCM1555C1H271FA16D_270pF]  (hidden comment: Cap_Murata_GCM1555C1H271FA16D_270pF)
C289  Capacitance: 270pF 50V C0G 0402  [Cap_Murata_GCM1555C1H271FA16D_270pF]  (hidden comment: Cap_Murata_GCM1555C1H271FA16D_270pF)
C290  Capacitance: 150pF 50V C0G 0402  [Cap_TDK_CGA2B2C0G2A151J050BE_150pF]  (hidden comment: Cap_TDK_CGA2B2C0G2A151J050BE_150pF)
C291  Capacitance: 150pF 50V C0G 0402  [Cap_TDK_CGA2B2C0G2A151J050BE_150pF]  (hidden comment: Cap_TDK_CGA2B2C0G2A151J050BE_150pF)
C292  Capacitance: 270pF 50V C0G 0402  [Cap_Murata_GCM1555C1H271FA16D_270pF]  (hidden comment: Cap_Murata_GCM1555C1H271FA16D_270pF)
C293  Capacitance: 270pF 50V C0G 0402  [Cap_Murata_GCM1555C1H271FA16D_270pF]  (hidden comment: Cap_Murata_GCM1555C1H271FA16D_270pF)
C294  Capacitance: 150pF 50V C0G 0402  [Cap_TDK_CGA2B2C0G2A151J050BE_150pF]  (hidden comment: Cap_TDK_CGA2B2C0G2A151J050BE_150pF)
C295  Capacitance: 150pF 50V C0G 0402  [Cap_TDK_CGA2B2C0G2A151J050BE_150pF]  (hidden comment: Cap_TDK_CGA2B2C0G2A151J050BE_150pF)
C296  Capacitance: 270pF 50V C0G 0402  [Cap_Murata_GCM1555C1H271FA16D_270pF]  (hidden comment: Cap_Murata_GCM1555C1H271FA16D_270pF)
C297  Capacitance: 270pF 50V C0G 0402  [Cap_Murata_GCM1555C1H271FA16D_270pF]  (hidden comment: Cap_Murata_GCM1555C1H271FA16D_270pF)
C298  Capacitance: 150pF 50V C0G 0402  [Cap_TDK_CGA2B2C0G2A151J050BE_150pF]  (hidden comment: Cap_TDK_CGA2B2C0G2A151J050BE_150pF)
C299  Capacitance: 150pF 50V C0G 0402  [Cap_TDK_CGA2B2C0G2A151J050BE_150pF]  (hidden comment: Cap_TDK_CGA2B2C0G2A151J050BE_150pF)
C300  Capacitance: 270pF 50V C0G 0402  [Cap_Murata_GCM1555C1H271FA16D_270pF]  (hidden comment: Cap_Murata_GCM1555C1H271FA16D_270pF)
C301  Capacitance: 270pF 50V C0G 0402  [Cap_Murata_GCM1555C1H271FA16D_270pF]  (hidden comment: Cap_Murata_GCM1555C1H271FA16D_270pF)
C302  Capacitance: 150pF 50V C0G 0402  [Cap_TDK_CGA2B2C0G2A151J050BE_150pF]  (hidden comment: Cap_TDK_CGA2B2C0G2A151J050BE_150pF)
C303  Capacitance: 150pF 50V C0G 0402  [Cap_TDK_CGA2B2C0G2A151J050BE_150pF]  (hidden comment: Cap_TDK_CGA2B2C0G2A151J050BE_150pF)
C304  Capacitance: 270pF 50V C0G 0402  [Cap_Murata_GCM1555C1H271FA16D_270pF]  (hidden comment: Cap_Murata_GCM1555C1H271FA16D_270pF)
C305  Capacitance: 270pF 50V C0G 0402  [Cap_Murata_GCM1555C1H271FA16D_270pF]  (hidden comment: Cap_Murata_GCM1555C1H271FA16D_270pF)
C306  Capacitance: 150pF 50V C0G 0402  [Cap_TDK_CGA2B2C0G2A151J050BE_150pF]  (hidden comment: Cap_TDK_CGA2B2C0G2A151J050BE_150pF)
C307  Capacitance: 150pF 50V C0G 0402  [Cap_TDK_CGA2B2C0G2A151J050BE_150pF]  (hidden comment: Cap_TDK_CGA2B2C0G2A151J050BE_150pF)
C308  Capacitance: 270pF 50V C0G 0402  [Cap_Murata_GCM1555C1H271FA16D_270pF]  (hidden comment: Cap_Murata_GCM1555C1H271FA16D_270pF)
C309  Capacitance: 270pF 50V C0G 0402  [Cap_Murata_GCM1555C1H271FA16D_270pF]  (hidden comment: Cap_Murata_GCM1555C1H271FA16D_270pF)
C310  Capacitance: 150pF 50V C0G 0402  [Cap_TDK_CGA2B2C0G2A151J050BE_150pF]  (hidden comment: Cap_TDK_CGA2B2C0G2A151J050BE_150pF)
C311  Capacitance: 150pF 50V C0G 0402  [Cap_TDK_CGA2B2C0G2A151J050BE_150pF]  (hidden comment: Cap_TDK_CGA2B2C0G2A151J050BE_150pF)
C312  Capacitance: 270pF 50V C0G 0402  [Cap_Murata_GCM1555C1H271FA16D_270pF]  (hidden comment: Cap_Murata_GCM1555C1H271FA16D_270pF)
C313  Capacitance: 270pF 50V C0G 0402  [Cap_Murata_GCM1555C1H271FA16D_270pF]  (hidden comment: Cap_Murata_GCM1555C1H271FA16D_270pF)
C314  Capacitance: 150pF 50V C0G 0402  [Cap_TDK_CGA2B2C0G2A151J050BE_150pF]  (hidden comment: Cap_TDK_CGA2B2C0G2A151J050BE_150pF)
L10  470nH 0402 5%  Current Rating: 50mA  [TDK_MLF1005GR47JT000_0]
L11  510nH 0402 2%  Current Rating: 70mA  [TDK_MHQ1005PR51GT000_0]
L12  470nH 0402 5%  Current Rating: 50mA  [TDK_MLF1005GR47JT000_0]
L13  470nH 0402 5%  Current Rating: 50mA  [TDK_MLF1005GR47JT000_0]
L14  510nH 0402 2%  Current Rating: 70mA  [TDK_MHQ1005PR51GT000_0]
L15  470nH 0402 5%  Current Rating: 50mA  [TDK_MLF1005GR47JT000_0]
L16  470nH 0402 5%  Current Rating: 50mA  [TDK_MLF1005GR47JT000_0]
L17  510nH 0402 2%  Current Rating: 70mA  [TDK_MHQ1005PR51GT000_0]
L18  470nH 0402 5%  Current Rating: 50mA  [TDK_MLF1005GR47JT000_0]
L19  470nH 0402 5%  Current Rating: 50mA  [TDK_MLF1005GR47JT000_0]
L20  510nH 0402 2%  Current Rating: 70mA  [TDK_MHQ1005PR51GT000_0]
L21  470nH 0402 5%  Current Rating: 50mA  [TDK_MLF1005GR47JT000_0]
L22  470nH 0402 5%  Current Rating: 50mA  [TDK_MLF1005GR47JT000_0]
L23  510nH 0402 2%  Current Rating: 70mA  [TDK_MHQ1005PR51GT000_0]
L24  470nH 0402 5%  Current Rating: 50mA  [TDK_MLF1005GR47JT000_0]
L25  470nH 0402 5%  Current Rating: 50mA  [TDK_MLF1005GR47JT000_0]
L26  510nH 0402 2%  Current Rating: 70mA  [TDK_MHQ1005PR51GT000_0]
L27  470nH 0402 5%  Current Rating: 50mA  [TDK_MLF1005GR47JT000_0]
L28  470nH 0402 5%  Current Rating: 50mA  [TDK_MLF1005GR47JT000_0]
L29  510nH 0402 2%  Current Rating: 70mA  [TDK_MHQ1005PR51GT000_0]
L30  470nH 0402 5%  Current Rating: 50mA  [TDK_MLF1005GR47JT000_0]
L31  470nH 0402 5%  Current Rating: 50mA  [TDK_MLF1005GR47JT000_0]
L32  510nH 0402 2%  Current Rating: 70mA  [TDK_MHQ1005PR51GT000_0]
L33  470nH 0402 5%  Current Rating: 50mA  [TDK_MLF1005GR47JT000_0]
L34  470nH 0402 5%  Current Rating: 50mA  [TDK_MLF1005GR47JT000_0]
L35  510nH 0402 2%  Current Rating: 70mA  [TDK_MHQ1005PR51GT000_0]
L36  470nH 0402 5%  Current Rating: 50mA  [TDK_MLF1005GR47JT000_0]
R261  18R 1% 0402  [RESC0402(1005)_L]
R262  18R 1% 0402  [RESC0402(1005)_L]
R263  300R 1% 0402  [RESC0402(1005)_L]
R264  300R 1% 0402  [RESC0402(1005)_L]
R265  300R 1% 0402  [RESC0402(1005)_L]
R266  300R 1% 0402  [RESC0402(1005)_L]
R267  18R 1% 0402  [RESC0402(1005)_L]
R268  18R 1% 0402  [RESC0402(1005)_L]
R269  300R 1% 0402  [RESC0402(1005)_L]
R270  300R 1% 0402  [RESC0402(1005)_L]
R271  300R 1% 0402  [RESC0402(1005)_L]
R272  300R 1% 0402  [RESC0402(1005)_L]
R273  18R 1% 0402  [RESC0402(1005)_L]
R274  18R 1% 0402  [RESC0402(1005)_L]
R275  300R 1% 0402  [RESC0402(1005)_L]
R276  300R 1% 0402  [RESC0402(1005)_L]
R277  300R 1% 0402  [RESC0402(1005)_L]
R278  300R 1% 0402  [RESC0402(1005)_L]
R279  18R 1% 0402  [RESC0402(1005)_L]
R280  18R 1% 0402  [RESC0402(1005)_L]
R281  300R 1% 0402  [RESC0402(1005)_L]
R282  300R 1% 0402  [RESC0402(1005)_L]
R283  300R 1% 0402  [RESC0402(1005)_L]
R284  300R 1% 0402  [RESC0402(1005)_L]
R285  18R 1% 0402  [RESC0402(1005)_L]
R286  300R 1% 0402  [RESC0402(1005)_L]
R287  300R 1% 0402  [RESC0402(1005)_L]

### Blocks framed on the sheet
-3 dB: R261 R263 R264
-3 dB: R262 R265 R266
-3 dB: R267 R269 R270
-3 dB: R268 R271 R272
-3 dB: R273 R275 R276
-3 dB: R274 R277 R278
-3 dB: R279 R281 R282
-3 dB: R280 R283 R284
-3 dB: R285-R287

### Ports
TC_SINUS_0 (out), TC_SINUS_1 (out), TC_SINUS_2 (out), TC_SINUS_3 (out), TC_SINUS_4 (out), TC_SINUS_5 (out), TC_SINUS_6 (out), TC_SINUS_7 (out), TC_SINUS_8 (out), TCA_CLK0 (in), TCA_CLK1 (in), TCA_CLK2 (in), TCA_CLK3 (in), TCA_CLK4 (in), TCA_CLK5 (in), TCA_CLK6 (in), TCA_CLK7 (in), TCA_CLK8 (in)

### Nets
TRB_GND: C279.1 C280.1 C281.1 C282.1 C283.1 C284.1 C285.1 C286.1 C287.1 C288.1 C289.1 C290.1 C291.1 C292.1 C293.1 C294.1 C295.1 C296.1 C297.1 C298.1 C299.1 C300.1 C301.1 C302.1 C303.1 C304.1 C305.1 C306.1 C307.1 C308.1 C309.1 C310.1 C311.1 C312.1 C313.1 C314.1 R263.1 R264.1 R265.1 R266.1 R269.1 R270.1 R271.1 R272.1 R275.1 R276.1 R277.1 R278.1 R281.1 R282.1 R283.1 R284.1 R286.1 R287.1
TC_0: R261.2 R264.2 ; port TC_SINUS_0
TC_1: R267.2 R270.2 ; port TC_SINUS_1
TC_2: R273.2 R276.2 ; port TC_SINUS_2
TC_3: R279.2 R282.2 ; port TC_SINUS_3
TC_4: R285.2 R287.2 ; port TC_SINUS_4
TC_5: R262.2 R266.2 ; port TC_SINUS_5
TC_6: R268.2 R271.2 ; port TC_SINUS_6
TC_7: R274.2 R277.2 ; port TC_SINUS_7
TC_8: R280.2 R284.2 ; port TC_SINUS_8
TCA_CLK0: C279.2 L10.1 ; port TCA_CLK0
TCA_CLK1: C287.2 L16.1 ; port TCA_CLK1
TCA_CLK2: C295.2 L22.1 ; port TCA_CLK2
TCA_CLK3: C303.2 L28.1 ; port TCA_CLK3
TCA_CLK4: C311.2 L34.1 ; port TCA_CLK4
TCA_CLK5: C283.2 L13.1 ; port TCA_CLK5
TCA_CLK6: C291.2 L19.1 ; port TCA_CLK6
TCA_CLK7: C299.2 L25.1 ; port TCA_CLK7
TCA_CLK8: C307.2 L31.1 ; port TCA_CLK8
NetC280_2: C280.2 L10.2 L11.1
NetC281_2: C281.2 L11.2 L12.1
NetC282_2: C282.2 L12.2 R261.1 R263.2
NetC284_2: C284.2 L13.2 L14.1
NetC285_2: C285.2 L14.2 L15.1
NetC286_2: C286.2 L15.2 R262.1 R265.2
NetC288_2: C288.2 L16.2 L17.1
NetC289_2: C289.2 L17.2 L18.1
NetC290_2: C290.2 L18.2 R267.1 R269.2
NetC292_2: C292.2 L19.2 L20.1
NetC293_2: C293.2 L20.2 L21.1
NetC294_2: C294.2 L21.2 R268.1 R272.2
NetC296_2: C296.2 L22.2 L23.1
NetC297_2: C297.2 L23.2 L24.1
NetC298_2: C298.2 L24.2 R273.1 R275.2
NetC300_2: C300.2 L25.2 L26.1
NetC301_2: C301.2 L26.2 L27.1
NetC302_2: C302.2 L27.2 R274.1 R278.2
NetC304_2: C304.2 L28.2 L29.1
NetC305_2: C305.2 L29.2 L30.1
NetC306_2: C306.2 L30.2 R279.1 R281.2
NetC308_2: C308.2 L31.2 L32.1
NetC309_2: C309.2 L32.2 L33.1
NetC310_2: C310.2 L33.2 R280.1 R283.2
NetC312_2: C312.2 L34.2 L35.1
NetC313_2: C313.2 L35.2 L36.1
NetC314_2: C314.2 L36.2 R285.1 R286.2

### Layout directives
net class S50: (no net found under the mark)

### Notes on the sheet
- 7th order Chebyshev: ~430 mVpp, 25 MHz sinusoid
- 475 Portola Plaza
- GAPS TOF
- igarcia91@g.ucla.edu
- Los Angeles, CA
- 310-825-0344
- Size:
- Date:
- Letter
- Revision:
- Time:
- Sheet
- of
- andrew.peck@cern.ch
- spq@ucla.edu
- File:

### Library data of the parts
C279 C282 C283 C286 C287 C290 C291 C294 C295 C298 C299 C302 C303 C306 C307 C310 C311 C314 = Cap_TDK_CGA2B2C0G2A151J050BE_150pF: CAP 150pF 50V C0G ±1% 0402 (1000 Metric) Thickness 1mm SMD; Supplier 1: Mouser; Supplier Part Number 1: 810-CGA2B2C0G2A151J0
C280 C281 C284 C285 C288 C289 C292 C293 C296 C297 C300 C301 C304 C305 C308 C309 C312 C313 = Cap_Murata_GCM1555C1H271FA16D_270pF: CAP 270pF 50V C0G ±1% 0402; Supplier 1: Mouser; Supplier Part Number 1: 81-GCM1555C1H271FA6D
L10 L12 L13 L15 L16 L18 L19 L21 L22 L24 L25 L27 L28 L30 L31 L33 L34 L36 = Ind_TDK_MLF1005GR47JT000: IND 470nH Shielded Multilayer Inductor 50mA 420 mOhm Max 0402 (1005 Metric); Manufacturer: TDK; Value: 270.0nH; DC Resistance (DCR): 420mOhms; Part Number: MLF1005GR47JT000; ComponentLink2Description: Datasheet; Temperature: -55°C to +125°C; ComponentLink2URL: https://product.tdk.com/info/en/catalog/datasheets/inductor_commercial_decoupling_mlz1608_en.pdf; RoHS: TRUE; Temperature Range High: +125°C; Lead Free: yes; Temperature Range Low: -55°C; Tolerance: ±5%; Package: 0402 (1005); Inductance: 470nH; Supplier 1: Mouser; Supplier Part Number 1: 810-MLF1005GR47JT000
L11 L14 L17 L20 L23 L26 L29 L32 L35 = Ind_TDK_MHQ1005PR51GT000: IND 510nH Shielded Multilayer Inductor 70mA 10.2 Ohm Max 0402 (1005 Metric); Manufacturer: TDK; Value: 510.0nH; DC Resistance (DCR): 10.2Ohms; Part Number: MHQ1005PR51GT000; ComponentLink2Description: Datasheet; Temperature: -55°C to +125°C; ComponentLink2URL: https://product.tdk.com/info/en/catalog/datasheets/inductor_commercial_decoupling_mlz1608_en.pdf; RoHS: TRUE; Temperature Range High: +125°C; Lead Free: yes; Temperature Range Low: -55°C; Tolerance: ±2%; Package: 0402 (1005); Inductance: 510nH; Supplier Part Number 1: 810-MHQ1005PR51GT000; Supplier 1: Mouser
R261 R262 R267 R268 R273 R274 R279 R280 R285 = CMP-1011-00311-1: 18R 0.063W 1% 0402 (1005 Metric)  SMD; Case-EIA: 0402; Value: 18.00 Ohm; Case-Metric: 1005; Tolerance: 1 %; Power: 0.063 W; Technology: SMT
R263-R266 R269-R272 R275-R278 R281-R284 R286 R287 = CMP-1011-00449-1: 300R 0.063W 1% 0402 (1005 Metric)  SMD; Case-EIA: 0402; Value: 300.00 Ohm; Case-Metric: 1005; Tolerance: 1 %; Technology: SMT; Power: 0.063 W

## Sheet MARS_MIO.SchDoc: My title
size A3; Organization: University of California; Address1: 475 Portola Plaza; Address2: Los Angeles, CA 90095; DocumentNumber: 24; Revision: R01; SheetNumber: 24; SheetTotal: 35
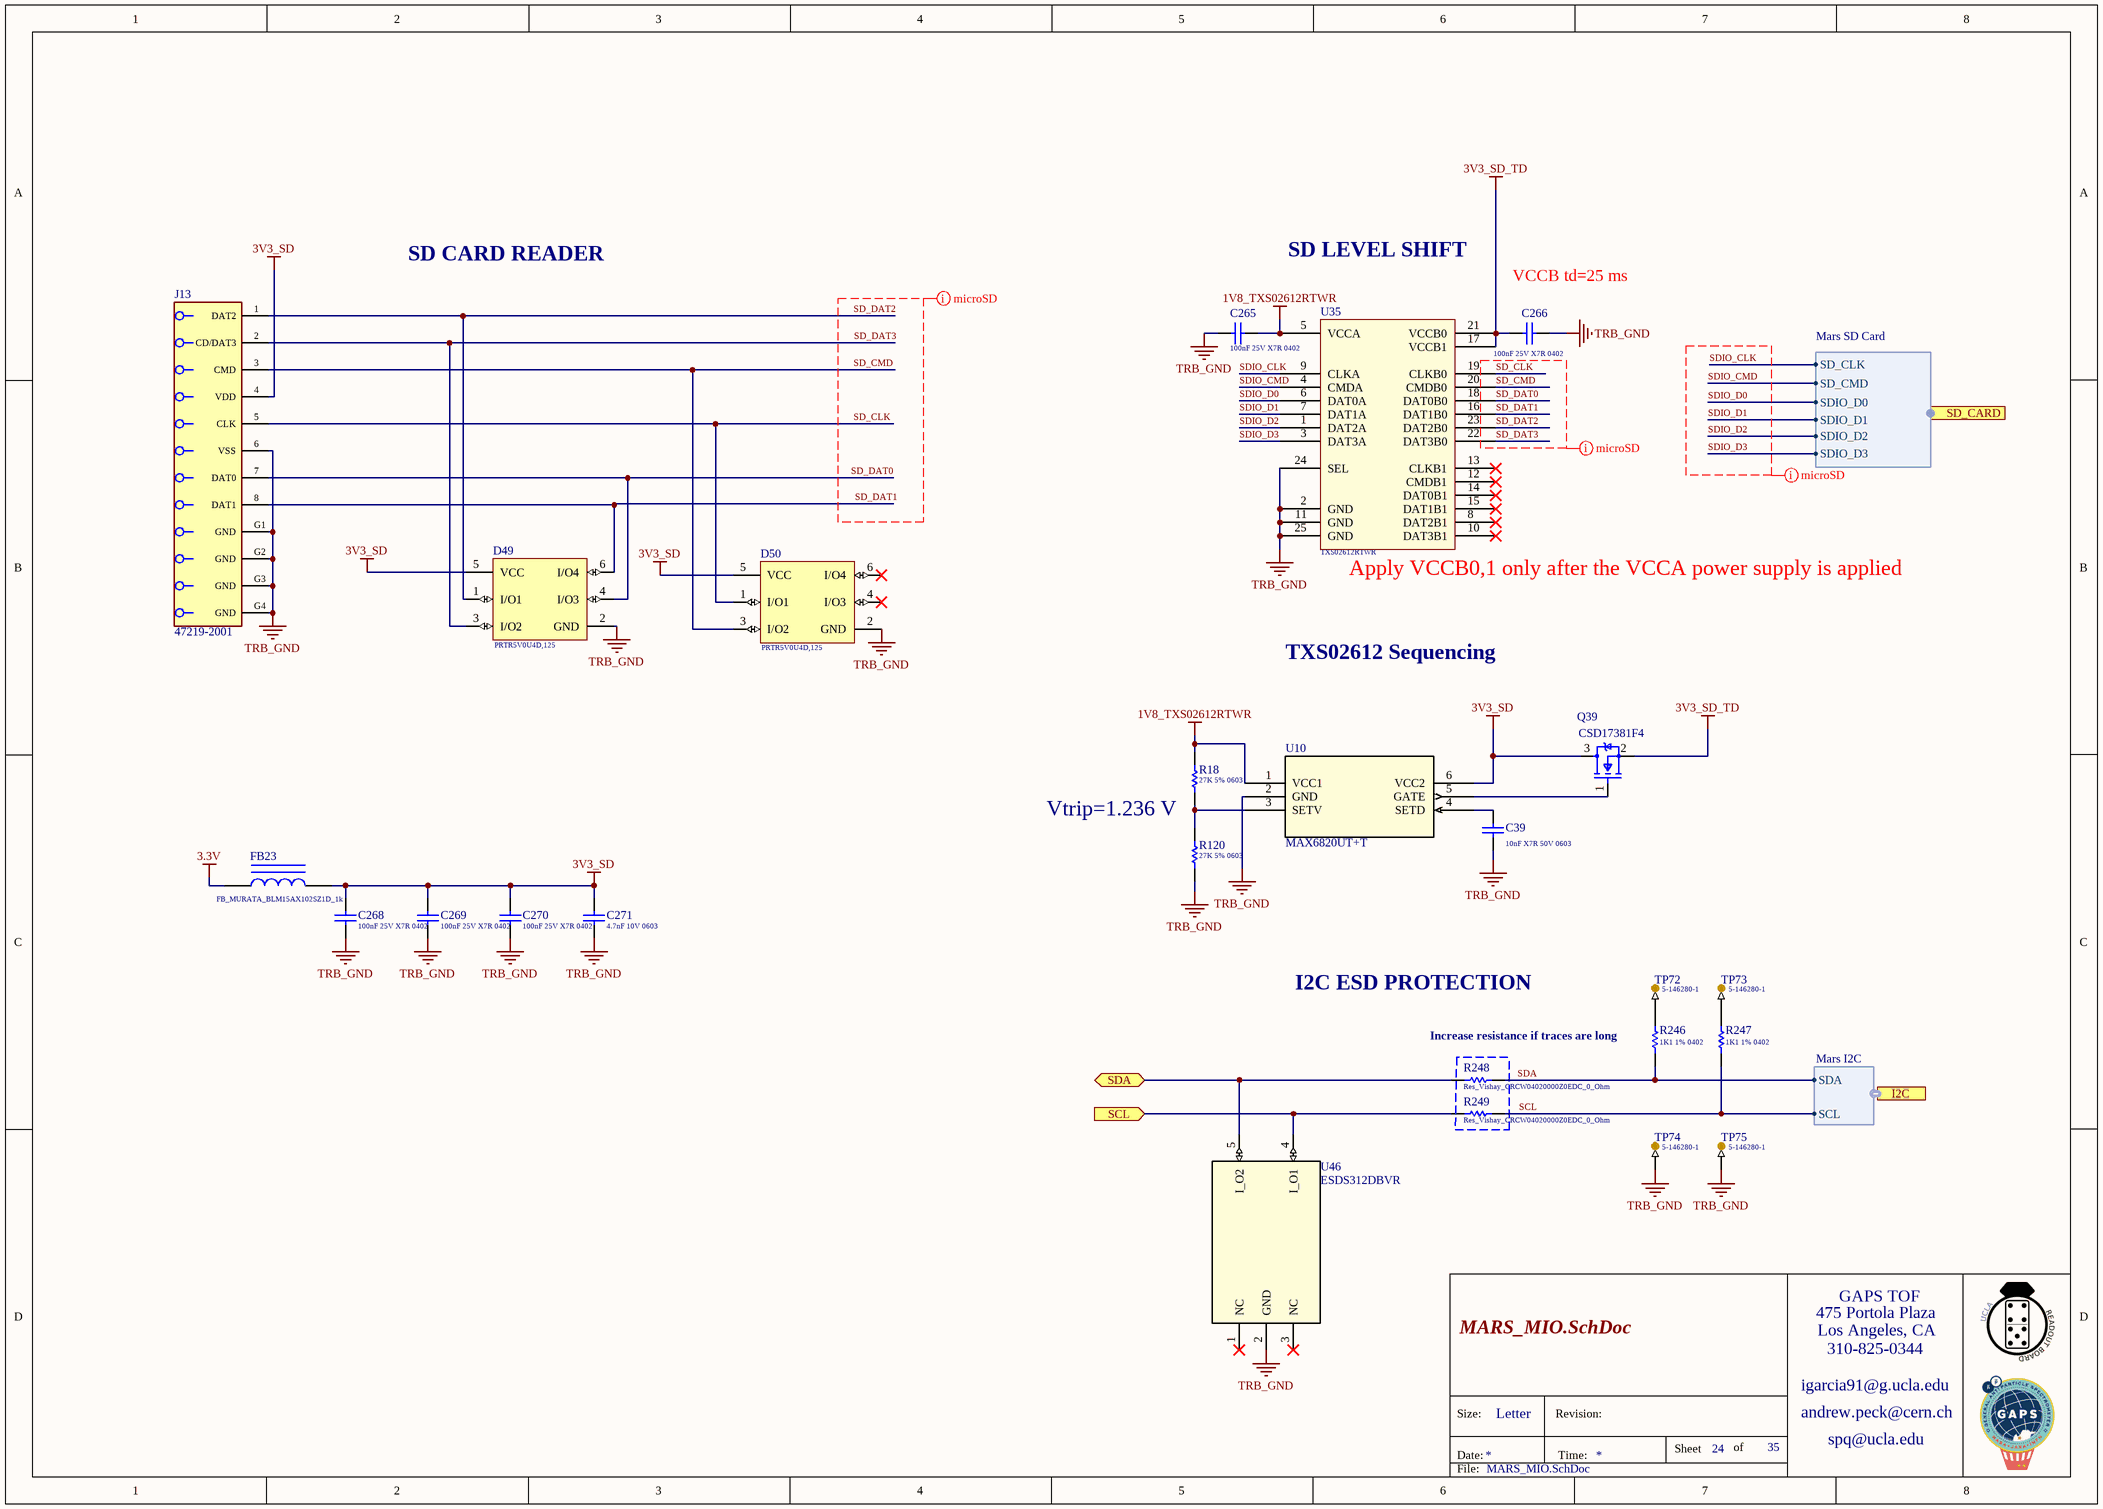
[diagram p13: MARS_MIO.SchDoc]

### Parts
C39  Capacitance: 10nF X7R 50V 0603  [Kemet_C0603_0]  (hidden comment: Cap_Kemet_C0603C103J5RACTU_eec)
C265  Capacitance: 100nF 25V X7R 0402  [Cap_Taiyo_Yuden_TMK105B7104KV-FR_100nF]  (hidden comment: Cap_Taiyo_Yuden_TMK105B7104KV-FR_100nF)
C266  Capacitance: 100nF 25V X7R 0402  [Cap_Taiyo_Yuden_TMK105B7104KV-FR_100nF]  (hidden comment: Cap_Taiyo_Yuden_TMK105B7104KV-FR_100nF)
C268  Capacitance: 100nF 25V X7R 0402  [Cap_Taiyo_Yuden_TMK105B7104KV-FR_100nF]  (hidden comment: Cap_Taiyo_Yuden_TMK105B7104KV-FR_100nF)
C269  Capacitance: 100nF 25V X7R 0402  [Cap_Taiyo_Yuden_TMK105B7104KV-FR_100nF]  (hidden comment: Cap_Taiyo_Yuden_TMK105B7104KV-FR_100nF)
C270  Capacitance: 100nF 25V X7R 0402  [Cap_Taiyo_Yuden_TMK105B7104KV-FR_100nF]  (hidden comment: Cap_Taiyo_Yuden_TMK105B7104KV-FR_100nF)
C271  4.7nF 10V 0603  [CAPC0603(1608)100_L]
D49  PRTR5V0U4D,125  [PRTR5V0U4D,125]
D50  PRTR5V0U4D,125  [PRTR5V0U4D,125]
FB23  FB_MURATA_BLM15AX102SZ1D_1k  [FB_MURATA_BLM15AX102SZ1D_1k]
J13  Part Number: 47219-2001  [Molex_47219-2001_0]  (hidden comment: Conn_Molex_47219-2001_eec)
Q39  CSD17381F4  [Texas_Instruments_3-PICOSTAR_0]
R18  27K 5% 0603  [RESC0603(1608)_L]
R120  27K 5% 0603  [RESC0603(1608)_L]
R246  1K1 1% 0402  [RESC0402(1005)_L]
R247  1K1 1% 0402  [RESC0402(1005)_L]
R248  Res_Vishay_CRCW04020000Z0EDC_0_Ohm  [Res_Vishay_CRCW04020000Z0EDC_0_Ohm]
R249  Res_Vishay_CRCW04020000Z0EDC_0_Ohm  [Res_Vishay_CRCW04020000Z0EDC_0_Ohm]
TP72  Series: 5-146280-1  [TP_TE_Connectivity_5-146280-1_1POS]  (hidden comment: TP_TE_Connectivity_5-146280-1_1POS)
TP73  Series: 5-146280-1  [TP_TE_Connectivity_5-146280-1_1POS]  (hidden comment: TP_TE_Connectivity_5-146280-1_1POS)
TP74  Series: 5-146280-1  [TP_TE_Connectivity_5-146280-1_1POS]  (hidden comment: TP_TE_Connectivity_5-146280-1_1POS)
TP75  Series: 5-146280-1  [TP_TE_Connectivity_5-146280-1_1POS]  (hidden comment: TP_TE_Connectivity_5-146280-1_1POS)
U10  MAX6820UT+T  [21-0058I_MXM]
U35  Series: TXS02612RTWR  [IC_TXS02612RTWR_SD_Level_Shifter]  (hidden comment: IC_TXS02612RTWR_SD_Level_Shifter)
U46  ESDS312DBVR  [DBV0005A_L]

### Ports
I2C (harness Mars I2C), SCL (in), SD_CARD (harness Mars SD Card), SDA (bidir)

### Harnesses
Mars SD Card: SDIO_D2, SDIO_D1, SDIO_D0, SD_CMD, SD_CLK, SDIO_D3
Mars I2C: SCL, SDA

### Nets
1V8_TXS02612RTWR: C265.1 R18.2 U10.1(VCC1) U35.5(VCCA)
3.3V: FB23.1
3V3_SD: C268.2 C269.2 C270.2 C271.1 D49.5(VCC) D50.5(VCC) FB23.2 J13.4(VDD) Q39.3(DRAIN) U10.6(VCC2)
3V3_SD_TD: C266.2 Q39.2(SOURCE) U35.17(VCCB1) U35.21(VCCB0)
TRB_GND: C39.2 C265.2 C266.1 C268.1 C269.1 C270.1 C271.2 D49.2(GND) D50.2(GND) J13.6(VSS) J13.G1(GND) J13.G2(GND) J13.G3(GND) J13.G4(GND) R120.1 TP74.1 TP75.1 U10.2(GND) U35.2(GND) U35.11(GND) U35.24(SEL) U35.25(GND) U46.2(GND)
I2C_SCL: R249.2 U46.4(I_O1) ; port SCL
I2C_SDA: R248.2 U46.5(I_O2) ; port SDA
SCL: R247.1 R249.1 ; port I2C.SCL
SD_CLK: D50.1(I/O1) J13.5(CLK) U35.19(CLKB0)
SD_CMD: D50.3(I/O2) J13.3(CMD) U35.20(CMDB0)
SD_DAT0: D49.4(I/O3) J13.7(DAT0) U35.18(DAT0B0)
SD_DAT1: D49.6(I/O4) J13.8(DAT1) U35.16(DAT1B0)
SD_DAT2: D49.1(I/O1) J13.1(DAT2) U35.23(DAT2B0)
SD_DAT3: D49.3(I/O2) J13.2(CD/DAT3) U35.22(DAT3B0)
SDA: R246.1 R248.1 ; port I2C.SDA
SDIO_CLK: U35.9(CLKA) ; port SD_CARD.SD_CLK
SDIO_CMD: U35.4(CMDA) ; port SD_CARD.SD_CMD  [project net IO_MIO41_B13_L16_W9]
SDIO_D0: U35.6(DAT0A) ; port SD_CARD.SDIO_D0  [project net IO_MIO42_B13_L18_W11]
SDIO_D1: U35.7(DAT1A) ; port SD_CARD.SDIO_D1  [project net IO_MIO43_B13_L18_Y11]
SDIO_D2: U35.1(DAT2A) ; port SD_CARD.SDIO_D2  [project net IO_MIO44_B13_L14_SRCC_Y9]
SDIO_D3: U35.3(DAT3A) ; port SD_CARD.SDIO_D3  [project net IO_MIO45_B13_L14_Y8]
NetC39_1: C39.1 U10.4(SETD)
NetQ39_1: Q39.1(GATE) U10.5(GATE)
NetR18_1: R18.1 R120.2 U10.3(SETV)
NetR246_2: R246.2 TP72.1
NetR247_2: R247.2 TP73.1

Not connected (* = marked no-connect by the designer): D50 4(I/O3)* 6(I/O4)*; U35 8(DAT2B1)* 10(DAT3B1)* 12(CMDB1)* 13(CLKB1)* 14(DAT0B1)* 15(DAT1B1)*; U46 1(NC)* 3(NC)*

### Layout directives
net class S50; rule Matched Net Lengths [Tolerance = 100mil]: SD_CLK, SD_CMD, SD_DAT0, SD_DAT1, SD_DAT2, SD_DAT3, SDIO_CLK, SDIO_CMD, SDIO_D0, SDIO_D1, SDIO_D2, SDIO_D3

### Notes on the sheet
- SD CARD READER
- SD LEVEL SHIFT
- VCCB td=25 ms
- (near U35) Apply VCCB0,1 only after the VCCA power supply is applied
- TXS02612 Sequencing
- (near R18) Vtrip=1.236 V
- I2C ESD PROTECTION
- (near R246) Increase resistance if traces are long
- 475 Portola Plaza
- GAPS TOF
- igarcia91@g.ucla.edu
- Los Angeles, CA
- 310-825-0344
- Size:
- Date:
- Letter
- Revision:
- Time:
- Sheet
- of
- andrew.peck@cern.ch
- spq@ucla.edu
- File:

### Library data of the parts
C39 = Cap_Kemet_C0603C103J5RACTU_eec: as C94 on sheet CLK_SYNTH; Part Number: C0603C103J5RACTU; helpURL: https://upverter.com/upn/revision/8a8d0c297e33ac74/; ComponentLink2Description: Datasheet; Temperature: -55°C to +125°C; Package: C0603; Supplier 2: Mouser; Price: 0.0184203126773; Supplier 1: Digi-Key; ComponentLink1URL: https://upverter.com/upn/revision/8a8d0c297e33ac74/; Supplier Part Number 2: 80-C0603C103J5R; Supplier Part Number 1: 399-1092-1-ND; Value: 10nF; ComponentLink1Description: Upverter; ComponentLink2URL: https://content.kemet.com/datasheets/KEM_C1002_X7R_SMD.pdf; RoHS: TRUE; Mouser Part Number: 80-C0603C103J5R; Temperature Range High: +125°C; Digikey Description: CAP CER 10000PF 50V X7R 0603; Digikey Part Number: 399-1092-1-ND; Lead Free: yes; Temperature Range Low: -55°C; Voltage: 50V
C265 C266 C268-C270 = Cap_Taiyo_Yuden_TMK105B7104KV-FR_100nF: CAP CER 100nF 25V X7R 0402; Supplier 1: Mouser; Supplier Part Number 1: 963-TMK105B7104KV-FR
C271 = CMP-1035-02189-1: CAP 4.7nF 10V ±10% 0603 (1608 Metric) Thickness 1mm SMD; Case-Metric: 1608; Tolerance: Â±10%; Case-EIA: 0603; Max Thickness: 1 mm; Technology: SMT; Rated Voltage: 10 V; Value: 4.7nF
D49 D50 = PRTR5V0U4D,125: ESD Suppressors / TVS Diodes 5.5V QUAD R-R ESD ULTRA LOW CAP; Supplier 1: Mouser; Supplier Part Number 1: 771-PRTR5V0U4D-T/R
FB23 = FB_MURATA_BLM15AX102SZ1D_1k: FB SMD 1000 OHM 25% 3/4W 0402; Supplier Part Number 1: 81-BLM15AX102SZ1D; Supplier 1: Mouser
J13 = Conn_Molex_47219-2001_eec: CONN MICRO SD CARD HINGED TYPE; Manufacturer: Molex; Is Female: yes; helpURL: https://upverter.com/upn/revision/cf639670a30b6b80/; ComponentLink2Description: Datasheet; Temperature: -20°C to +85°C; Package: SMT_SDCARD_14MM5_13MM6; Supplier 2: Mouser; Supplier 1: Digi-Key; ComponentLink1URL: https://upverter.com/upn/revision/cf639670a30b6b80/; Supplier Part Number 2: 538-47219-2001; Supplier Part Number 1: WM6698CT-ND; ComponentLink1Description: Upverter; ComponentLink2URL: http://www.molex.com/pdm_docs/sd/472192001_sd.pdf; RoHS: TRUE; Mouser Part Number: 538-47219-2001; Temperature Range High: +85°C; Digikey Description: CONN MICRO SD CARD HINGED TYPE; Digikey Part Number: WM6698CT-ND; Lead Free: yes; Temperature Range Low: -20°C
Q39 = Trans_Texas_Instruments_CSD17381F4_eec: TRANS MOSFET N-CH 30V 3.1A 0402; Manufacturer: Texas Instruments; Mfg Package Ident: 3-PICOSTAR; Part Number: CSD17381F4; helpURL: https://upverter.com/upn/revision/4d3d13666fc1af7c/; ComponentLink2Description: Datasheet; Temperature: -55°C to +150°C; Package: 3-PICOSTAR; Supplier 2: Mouser; Price: 0.201706379017; Supplier 1: Digi-Key; ComponentLink1URL: https://upverter.com/upn/revision/4d3d13666fc1af7c/; Supplier Part Number 2: 595-CSD17381F4; Supplier Part Number 1: 296-38913-1-ND; ComponentLink1Description: Upverter; ComponentLink2URL: http://www.ti.com/lit/ds/symlink/csd17381f4.pdf; RoHS: TRUE; Mouser Part Number: 595-CSD17381F4; Temperature Range High: +150°C; Digikey Description: TRANS MOSFET N-CH 30V 3.1A 0402; Digikey Part Number: 296-38913-1-ND; Lead Free: yes; Temperature Range Low: -55°C
R18 R120 = CMP-1012-00108-1: 27K 0.1W 5% 0603 (1608 Metric)  SMD; Value: 27000.00 Ohm; Case-Metric: 1608; Case-EIA: 0603; Power: 0.1 W; Tolerance: 5 %; Technology: SMT
R246 R247 = CMP-1011-00514-1: 1K1 0.063W 1% 0402 (1005 Metric)  SMD; Case-Metric: 1005; Case-EIA: 0402; Value: 1100.00 Ohm; Power: 0.063 W; Tolerance: 1 %; Technology: SMT
R248 R249 = Res_Vishay_CRCW04020000Z0EDC_0_Ohm: 0R 0.062W 1% 0402 (1005 Metric)  SMD; Resistance: 0R 1% 0402; Supplier 1: Mouser; Supplier Part Number 1: 71-CRCW04020000Z0EDC
TP72-TP75 = TP_TE_Connectivity_5-146280-1_1POS: Headers & Wire Housings Unshrouded 1 POS T/H; Supplier Part Number 1: 571-51462801; Supplier 1: Mouser
U10 = MAX6820UT+T: No Description Available; Vendor: Maxim Integrated Products; Built_By: EMA_UL_Team; SourceLibrary: Maxim_2014-06-20; Manufacturer_Part_Number: MAX6820UT+T; Revision: 1; Copyright: Copyright (C) 2018 Accelerated Designs. All rights reserved; RefDes: RefDes; Type: DEV
U35 = IC_TXS02612RTWR_SD_Level_Shifter: Interface - I/O Expanders SDIO Port Expander; Supplier Part Number 1: 595-TXS02612RTWR; Supplier 1: Mouser
U46 = ESDS312DBVR: 3.6V Data-Line Surge and 30kV ESD Protection Diode; Manufacturer: Texas Instruments; PartNumber: ESDS312DBVR; RefDes: RefDes; Type: DEV; Value: Value